# EAGLE schematic esp12_Epaper4.2 (EAGLE 9.6.0)
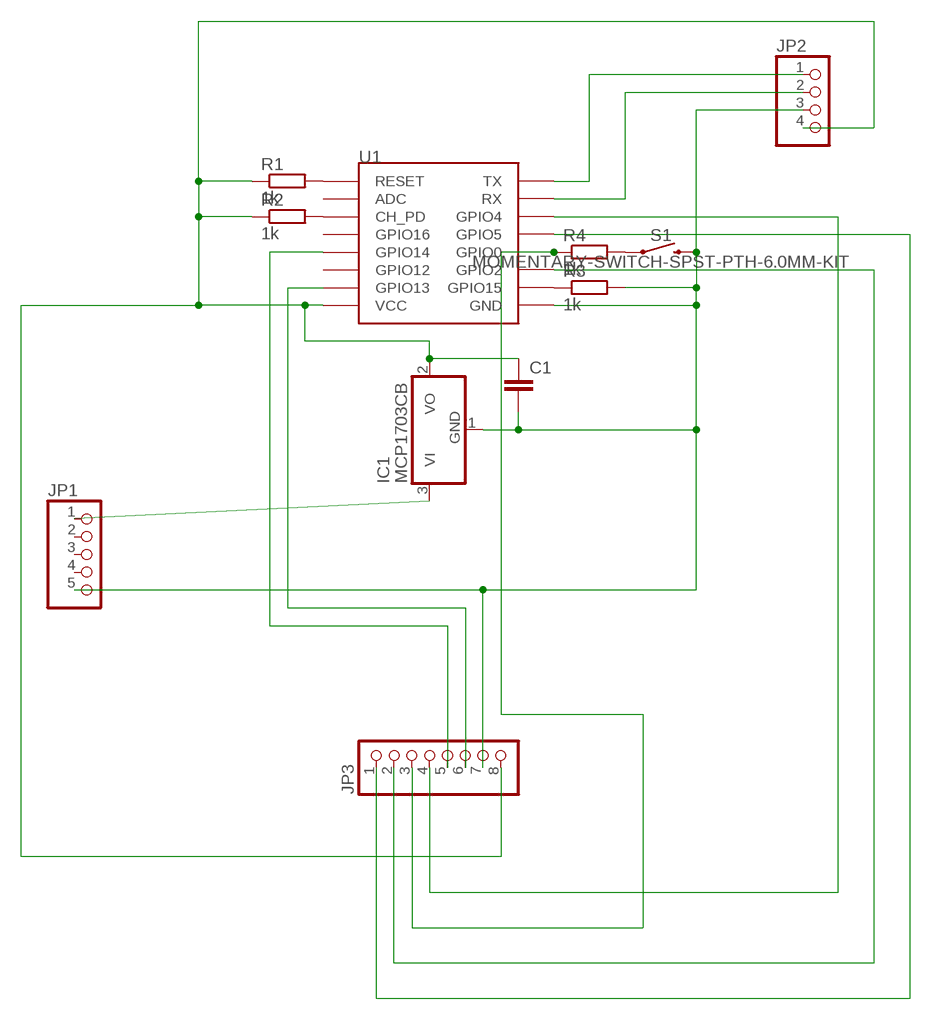
[diagram p0: schematic, sheet 1]

## Parts
C1  C-EU025-050X050  [C025-050X050]
IC1  MCP1703CB  [SOT23]
JP1  PINHD-1X5  [1X05]
JP2  PINHD-1X4/90  [1X04/90]
JP3  PINHD-1X8/90  [1X08/90]
R1  1k  R-EU_R1206  [R1206]
R2  1k  R-EU_R1206  [R1206]
R3  1k  R-EU_R1206  [R1206]
R4  1k  R-EU_R1206  [R1206]
S1  MOMENTARY-SWITCH-SPST-PTH-6.0MM-KIT  [TACTILE_SWITCH_PTH_6.0MM_KIT]
U1  ESP12  [ESP12]

## Nets
GND: C1.2 IC1.1(GND) JP1.5 JP2.3 JP3.7 R3.2 S1.3 U1.GND
N$2: R1.2 U1.RESET
N$3: R2.2 U1.CH_PD
N$4: JP3.3 R4.1 U1.GPIO0
N$5: R3.1 U1.GPIO15
N$6: R4.2 S1.1
N$7: JP2.1 U1.TX
N$8: JP2.2 U1.RX
N$10: IC1.3(VI) JP1.1
N$11: JP3.5 U1.GPIO14
N$12: JP3.6 U1.GPIO13
N$13: JP3.4 U1.GPIO4
N$14: JP3.2 U1.GPIO2
N$15: JP3.1 U1.GPIO5
VCC: C1.1 IC1.2(VO) JP2.4 JP3.8 R1.1 R2.1 U1.VCC
Unconnected: JP1.2 JP1.3 JP1.4 U1.ADC U1.GPIO12 U1.GPIO16

## Library data of the parts
C1 = rcl:C-EU: CAPACITOR, European symbol; SPICEPREFIX: C
IC1 = linear:MCP1703: 250 mA, 16V, Low Quiescent Current LDO Regulator Source: http://ww1.microchip.com/downloads/en/DeviceDoc/22049b.pdf
JP1 = pinhead:PINHD-1X5: PIN HEADER
JP2 = pinhead:PINHD-1X4: PIN HEADER
JP3 = pinhead:PINHD-1X8: PIN HEADER
R1-R4 = rcl:R-EU_: RESISTOR, European symbol; SPICEPREFIX: R
S1 = SparkFun-Switches:MOMENTARY-SWITCH-SPST: Momentary Switch (Pushbutton) - SPST Normally-open (NO) SPST momentary switches (buttons, pushbuttons). Variants PTH-12MM - 12mm square, through-hole Momentary Pushbutton Switch - 12mm Square <https://www.sparkfun.com/products/9190> (COM-09190) PTH-6.0MM, PTH-6.0MM-KIT - 6.0mm square, through-hole Mini Pushbutton Switch <https://www.sparkfun.com/products/97> (COM-00097) KIT package intended for soldering kit's - only one side of pads' copper is exposed. PTH-RIGHT-ANGLE-KIT - Right-angle, through-hole Right Angle Tactile Button <https://www.sparkfun.com/products/10791> - Used on SparkFun BigTime Watch Kit <https://www.sparkfun.com/products/11734> SMD-12MM - 12mm square, surface-mount Tactile Button - SMD (12mm) <https://www.sparkfun.com/products/12993> (COM-12993) Used on SparkFun PicoBoard <https://www.sparkfun.com/products/11888> SMD-4.5MM - 4.5mm Square Trackball Switch Used on SparkFun Blackberry Trackballer Breakout <https://www.sparkfun.com/products/13169> SMD-4.6MMX2.8MM - 4.60mm x 2.80mm, surface mount Used on SparkFun SAMD21 Mini Breakout <https://www.sparkfun.com/products/13664> SMD-5.2MM, SMD-5.2-REDUNDANT - 5.2mm square, surface-mount Mini Pushbutton Switch - SMD <https://www.sparkfun.com/products/8720> (COM-08720) Used on Arduino Pro Mini <https://www.sparkfun.com/products/11114> REDUNDANT package connects both switch circuits together SMD-6.0X3.5MM - 6.0 x 3.5mm, surface mount Momentary Reset Switch SMD <https://www.sparkfun.com/products/8229> (COM-08229) SMD-6.2MM-TALL - 6.2mm square, surface mount Tactile Button - SMD (6mm) <https://www.sparkfun.com/products/12992> Used on SparkFun Digital Sandbox <https://www.sparkfun.com/products/12651> SMD-RIGHT-ANGLE - Right-angle, surface mount Used on SparkFun Block for Intel® Edison - Arduino <https://www.sparkfun.com/products/13036>; PROD_ID: SWCH-08441; SF_SKU: COM-00097
U1 = esp8266modules:ESP12: ESP8266 Wifi module 12